# Altium schematic sheet Power and system. Page 7.SchDoc
size 420 x 297 mm; Address1: Address1; Address2: Address2; Address3: Address3; Address4: Address4; DocumentNumber: АБВГ.123456.001 Э3; SheetNumber: 7; SheetTotal: 7; Scale: 1:1; DocumentType: Схема электрическая принципиальная; FirstReferrence: АБВГ.123456.001
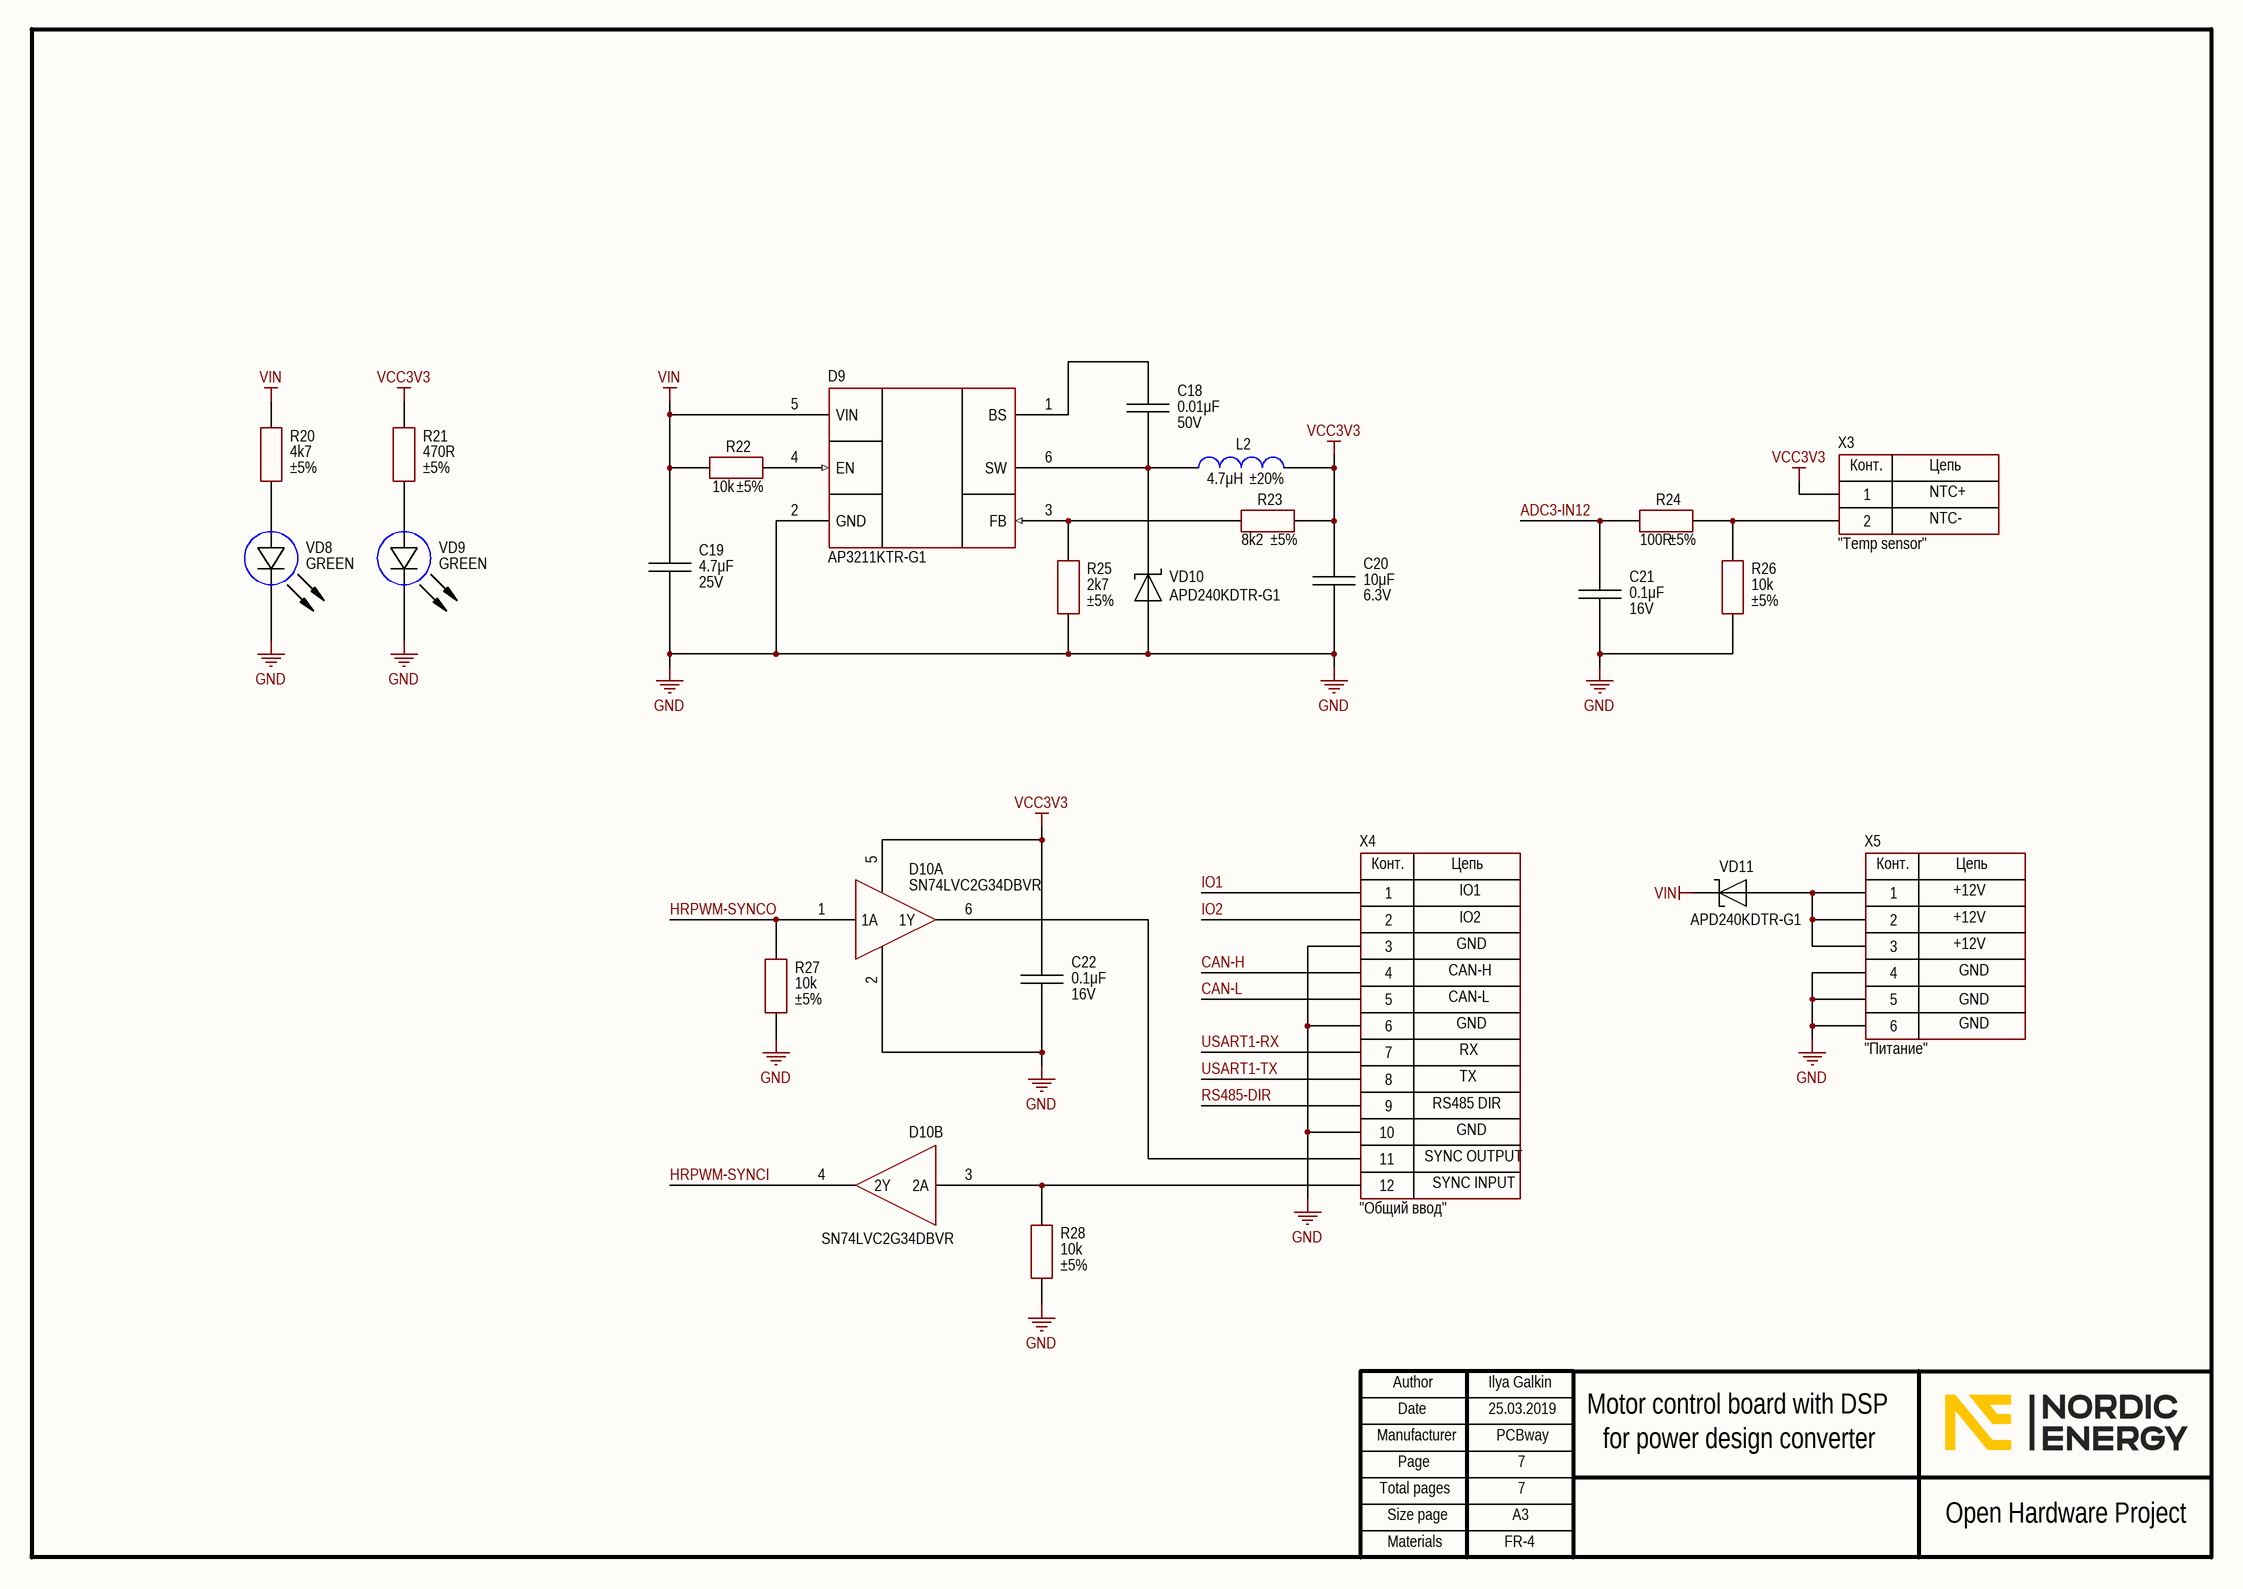
[diagram p0: Power and system. Page 7.SchDoc]

## Parts
C18  value 0.01μF  Voltage: 50V  [CAP: 0805]
C19  value 4.7μF  Voltage: 25V  [CAP: 0805]
C20  value 10μF  Voltage: 6.3V  [CAP: 0805]
C21  value 0.1μF  Voltage: 16V  [CAP: 0805]
C22  value 0.1μF  Voltage: 16V  [CAP: 0805]
D9  (no value)  [SOT23-6]
D10  (no value)  [SOT23-6]  (parts A,B of 2)
L2  value 4.7μH  Tolerance: ±20%  [IND: SRP2510A]
R20  value 4k7  Tolerance: ±5%  [RES: 0805]
R21  value 470R  Tolerance: ±5%  [RES: 0805]
R22  value 10k  Tolerance: ±5%  [RES: 0805]
R23  value 8k2  Tolerance: ±5%  [RES: 0805]
R24  value 100R  Tolerance: ±5%  [RES: 0805]
R25  value 2k7  Tolerance: ±5%  [RES: 0805]
R26  value 10k  Tolerance: ±5%  [RES: 0805]
R27  value 10k  Tolerance: ±5%  [RES: 0805]
R28  value 10k  Tolerance: ±5%  [RES: 0805]
VD8  Color: GREEN  [LED: 0603G]
VD9  Color: GREEN  [LED: 0603G]
VD10  PartNumber: APD240KDTR-G1  [DIODE: SOD123]
VD11  PartNumber: APD240KDTR-G1  [DIODE: SOD123]
X3  CommentText: "Temp sensor"  [CON: PLS-2]
X4  CommentText: "Общий ввод"  [CON: PBD-12]
X5  CommentText: "Питание"  [CON: PLD-6]

## Nets
GND: C19.1 C20.1 C21.1 C22.1 D9.2(GND) D10.2 R25.1 R26.1 R27.2 R28.2 VD8.2(C) VD9.2(C) VD10.1 X4.3 X4.6 X4.10 X5.4 X5.5 X5.6
VCC3V3: C20.2 C22.2 D10.5 L2.1 R21.2 R23.2 X3.1
VIN: C19.2 D9.5(VIN) R20.1 R22.1 VD11.2
ADC3-IN12: C21.2 R24.1
CAN-H: X4.4
CAN-L: X4.5
HRPWM-SYNCI: D10.4(2Y)
HRPWM-SYNCO: D10.1(1A) R27.1
IO1: X4.1
IO2: X4.2
RS485-DIR: X4.9
USART1-RX: X4.7
USART1-TX: X4.8
NetC18_1: C18.1 D9.6(SW) L2.2 VD10.2
NetC18_2: C18.2 D9.1(BS)
NetD9_3: D9.3(FB) R23.1 R25.2
NetD9_4: D9.4(EN) R22.2
NetD10_3: D10.3(2A) R28.1 X4.12
NetD10_6: D10.6(1Y) X4.11
NetR20_2: R20.2 VD8.1(A)
NetR21_1: R21.1 VD9.1(A)
NetR24_2: R24.2 R26.2 X3.2
NetVD11_1: VD11.1 X5.1 X5.2 X5.3

## Notes on the sheet
- NTC+
- NTC-
- IO1
- IO2
- +12V
- CAN-L
- CAN-H
- GND
- RX
- RS485 DIR
- TX
- SYNC OUTPUT
- SYNC INPUT
- Ilya Galkin
- 25.03.2019
- PCBway
- 7
- Motor control board with DSP
- for power design converter
- FR-4
- Author
- Manufacturer
- Date
- Page
- Total pages
- Size page
- A3
- Open Hardware Project
- Materials
- (in symbol PBD-12) Конт.; Цепь
- (in symbol PLD-6) Конт.; Цепь
- (in symbol PLS-2) Конт.; Цепь

## Library data of the parts
C18 = Ceramic_0805: Manufacturer: Yageo; PartNumber: CC0805KRX7R9BB103; ValueManufacturerPartNumber: Ceramic capacitor, 0.01μF, X7R, ±10%, 50V, 0805, -55...+125°C; TypeCapacitor: Ceramic capacitor; Tolerance: ±10%; TypeDielectric: X7R; Package: 0805; HelpURL: https://www.digikey.com/product-detail/en/yageo/CC0805KRX7R9BB103/311-1136-1-ND/303046; Temperature: -55...+125°C
C19 = Ceramic_0805: Manufacturer: Samsung; PartNumber: CL21B475KAFNNNE; ValueManufacturerPartNumber: Ceramic capacitor, 4.7μF, X7R, ±10%, 25V, 0805, -55...+125°C; TypeCapacitor: Ceramic capacitor; Tolerance: ±10%; TypeDielectric: X7R; Package: 0805; HelpURL: https://www.digikey.com/product-detail/en/samsung-electro-mechanics/CL21B475KAFNNNE/1276-2969-1-ND/3891055; Temperature: -55...+125°C
C20 = Ceramic_0805: Manufacturer: Samsung; PartNumber: CL21B106KQQNNNE; ValueManufacturerPartNumber: Ceramic capacitor, 10μF, X7R, ±10%, 6.3V, 0805, -55...+125°C; TypeCapacitor: Ceramic capacitor; Tolerance: ±10%; TypeDielectric: X7R; Package: 0805; HelpURL: https://www.digikey.com/product-detail/en/samsung-electro-mechanics/CL21B106KQQNNNE/1276-1113-1-ND/3889199; Temperature: -55...+125°C
C21 C22 = Ceramic_0805: Manufacturer: Yageo; PartNumber: CC0805KRX7R7BB104; ValueManufacturerPartNumber: Ceramic capacitor, 0.1μF, X7R, ±10%, 16V, 0805, -55...+125°C; TypeCapacitor: Ceramic capacitor; Tolerance: ±10%; TypeDielectric: X7R; Package: 0805; HelpURL: https://www.digikey.com/product-detail/en/yageo/CC0805KRX7R7BB104/311-1142-1-ND/303052; Temperature: -55...+125°C
D9 = AP3211KTR-G1: Buck converter; Manufacturer: Diodes Incorporated; ValueManufacturerPartNumber: DC/DC buck converter, input 4.5...18V, 1.4MHz, output 0.81...15V, 1.5A, -40...+85°C, SOT23-6; VoltageInput: input 4.5...18V; Frequency: 1.4MHz; CurrentOutput: 1.5A; VoltageOutput: output 0.81...15V; HelpURL: https://www.digikey.com/product-detail/en/diodes-incorporated/AP3211KTR-G1/AP3211KTR-G1DICT-ND/4505305; Package: SOT23-6; ComponentType: DC/DC buck converter; Temperature: -40...+85°C; PartNumber: AP3211KTR-G1
D10 = SN74LVC2G34DBVR: Buffer; Manufacturer: Texas Instruments; ValueManufacturerPartNumber: IC logic buffer, 1.65...5.5V, -40...+125°C, SOT23-6; Supply: 1.65...5.5V; HelpURL: https://www.digikey.com/product-detail/en/texas-instruments/SN74LVC2G34DBVR/296-13496-1-ND/486431; Package: SOT23-6; ComponentType: IC logic buffer; Temperature: -40...+125°C; PartNumber: SN74LVC2G34DBVR
L2 = Inductor_SRP2510A: Manufacturer: Bourns; PartNumber: SRP2510A-4R7M; ValueManufacturerPartNumber: Fixed inductor, 4.7μH, ±20%, SRP2510A, 1.36A, -40...+125°C; TypeInductor: Fixed inductor; MaxCurrent: 1.36A; Package: SRP2510A; HelpURL: https://www.digikey.com/product-detail/en/bourns-inc/SRP2510A-4R7M/SRP2510A-4R7MCT-ND/7354840; Temperature: -40...+125°C
R20 = Resistor_0805: Manufacturer: Yageo; PartNumber: RC0805JR-074K7L; ValueManufacturerPartNumber: Resistor film, 4k7, ±5%, 0805, 0.125W, -55...+125°C; TypeResistor: Resistor film; Power: 0.125W; Package: 0805; HelpURL: https://www.digikey.com/product-detail/en/yageo/RC0805JR-074K7L/311-4.7KARCT-ND/731274; Temperature: -55...+125°C
R21 = Resistor_0805: Manufacturer: Yageo; PartNumber: RC0805JR-07470RL; ValueManufacturerPartNumber: Resistor film, 470R, ±5%, 0805, 0.125W, -55...+125°C; TypeResistor: Resistor film; Power: 0.125W; Package: 0805; HelpURL: https://www.digikey.com/product-detail/en/yageo/RC0805JR-07470RL/311-470ARCT-ND/731280; Temperature: -55...+125°C
R22 R26-R28 = Resistor_0805: Manufacturer: Yageo; PartNumber: RC0805JR-0710KL; ValueManufacturerPartNumber: Resistor film, 10k, ±5%, 0805, 0.125W, -55...+125°C; TypeResistor: Resistor film; Power: 0.125W; Package: 0805; HelpURL: https://www.digikey.com/product-detail/en/yageo/RC0805JR-0710KL/311-10KARCT-ND/731188; Temperature: -55...+125°C
R23 = Resistor_0805: Manufacturer: Yageo; PartNumber: RC0805JR-078K2L; ValueManufacturerPartNumber: Resistor film, 8k2, ±5%, 0805, 0.125W, -55...+125°C; TypeResistor: Resistor film; Power: 0.125W; Package: 0805; HelpURL: https://www.digikey.com/product-detail/en/yageo/RC0805JR-078K2L/311-8.2KARCT-ND/731320; Temperature: -55...+125°C
R24 = Resistor_0805: Manufacturer: Yageo; PartNumber: RC0805JR-07100RL; ValueManufacturerPartNumber: Resistor film, 100R, ±5%, 0805, 0.125W, -55...+125°C; TypeResistor: Resistor film; Power: 0.125W; Package: 0805; HelpURL: https://www.digikey.com/product-detail/en/yageo/RC0805JR-07100RL/311-100ARCT-ND/731185; Temperature: -55...+125°C
R25 = Resistor_0805: Manufacturer: Yageo; PartNumber: RC0805JR-072K7L; ValueManufacturerPartNumber: Resistor film, 2k7, ±5%, 0805, 0.125W, -55...+125°C; TypeResistor: Resistor film; Power: 0.125W; Package: 0805; HelpURL: https://www.digikey.com/product-detail/en/yageo/RC0805JR-072K7L/311-2.7KARCT-ND/731224; Temperature: -55...+125°C
VD8 VD9 = LED_single: Manufacturer: Wurth; ValueManufacturerPartNumber: LED, 20mA, 2V, 0805, -55...+150°C; PartNumber: 150080VS75000; TypeDiode: LED; Current: 20mA; VoltageDrop: 2V; Package: 0805; HelpURL: https://www.digikey.com/product-detail/en/wurth-electronics-inc/150080VS75000/732-4986-1-ND/4489922; Temperature: -55...+150°C
VD10 VD11 = Schottky_single: Manufacturer: Diodes Incorporated; ValueManufacturerPartNumber: Schottky diode, 40V, 2A, 500mV, 15pF, SOD-123, -55...+150°C; TypeDiode: Schottky diode; Voltage: 40V; Current: 2A; VoltageDrop: 500mV; RecoveryTime: 15pF; Package: SOD-123; HelpURL: https://www.digikey.com/product-detail/en/diodes-incorporated/APD240KDTR-G1/APD240KDTR-G1DICT-ND/7708824; Temperature: -55...+150°C
X3 = PLS-2: Manufacturer: Connfly; ValueManufacturerPartNumber: Connector, 2pin, 2.54mm, 500VAC, 3A; TypeConnector: Connector; VoltageMax: 500VAC; Pitch: 2.54mm; CurrentMax: 3A; Multichannel: 2pin; HelpURL: https://www.chipdip.ru/product/pls-2; PartNumber: PLS-2
X4 = PBD-12: Manufacturer: Connfly; ValueManufacturerPartNumber: Connector, 12pin, 2.54mm, 500VAC, 3A; TypeConnector: Connector; VoltageMax: 500VAC; Pitch: 2.54mm; CurrentMax: 3A; Multichannel: 12pin; HelpURL: https://www.chipdip.ru/product/pbd-12; PartNumber: PBD-12
X5 = PLD-6: Manufacturer: Connfly; ValueManufacturerPartNumber: Connector, 6pin, 2.54mm, 500VAC, 3A; TypeConnector: Connector; VoltageMax: 500VAC; Pitch: 2.54mm; CurrentMax: 3A; Multichannel: 6pin; HelpURL: https://www.chipdip.ru/product/pld-6; PartNumber: PLD-6